# Altium project robocar.PrjPcb
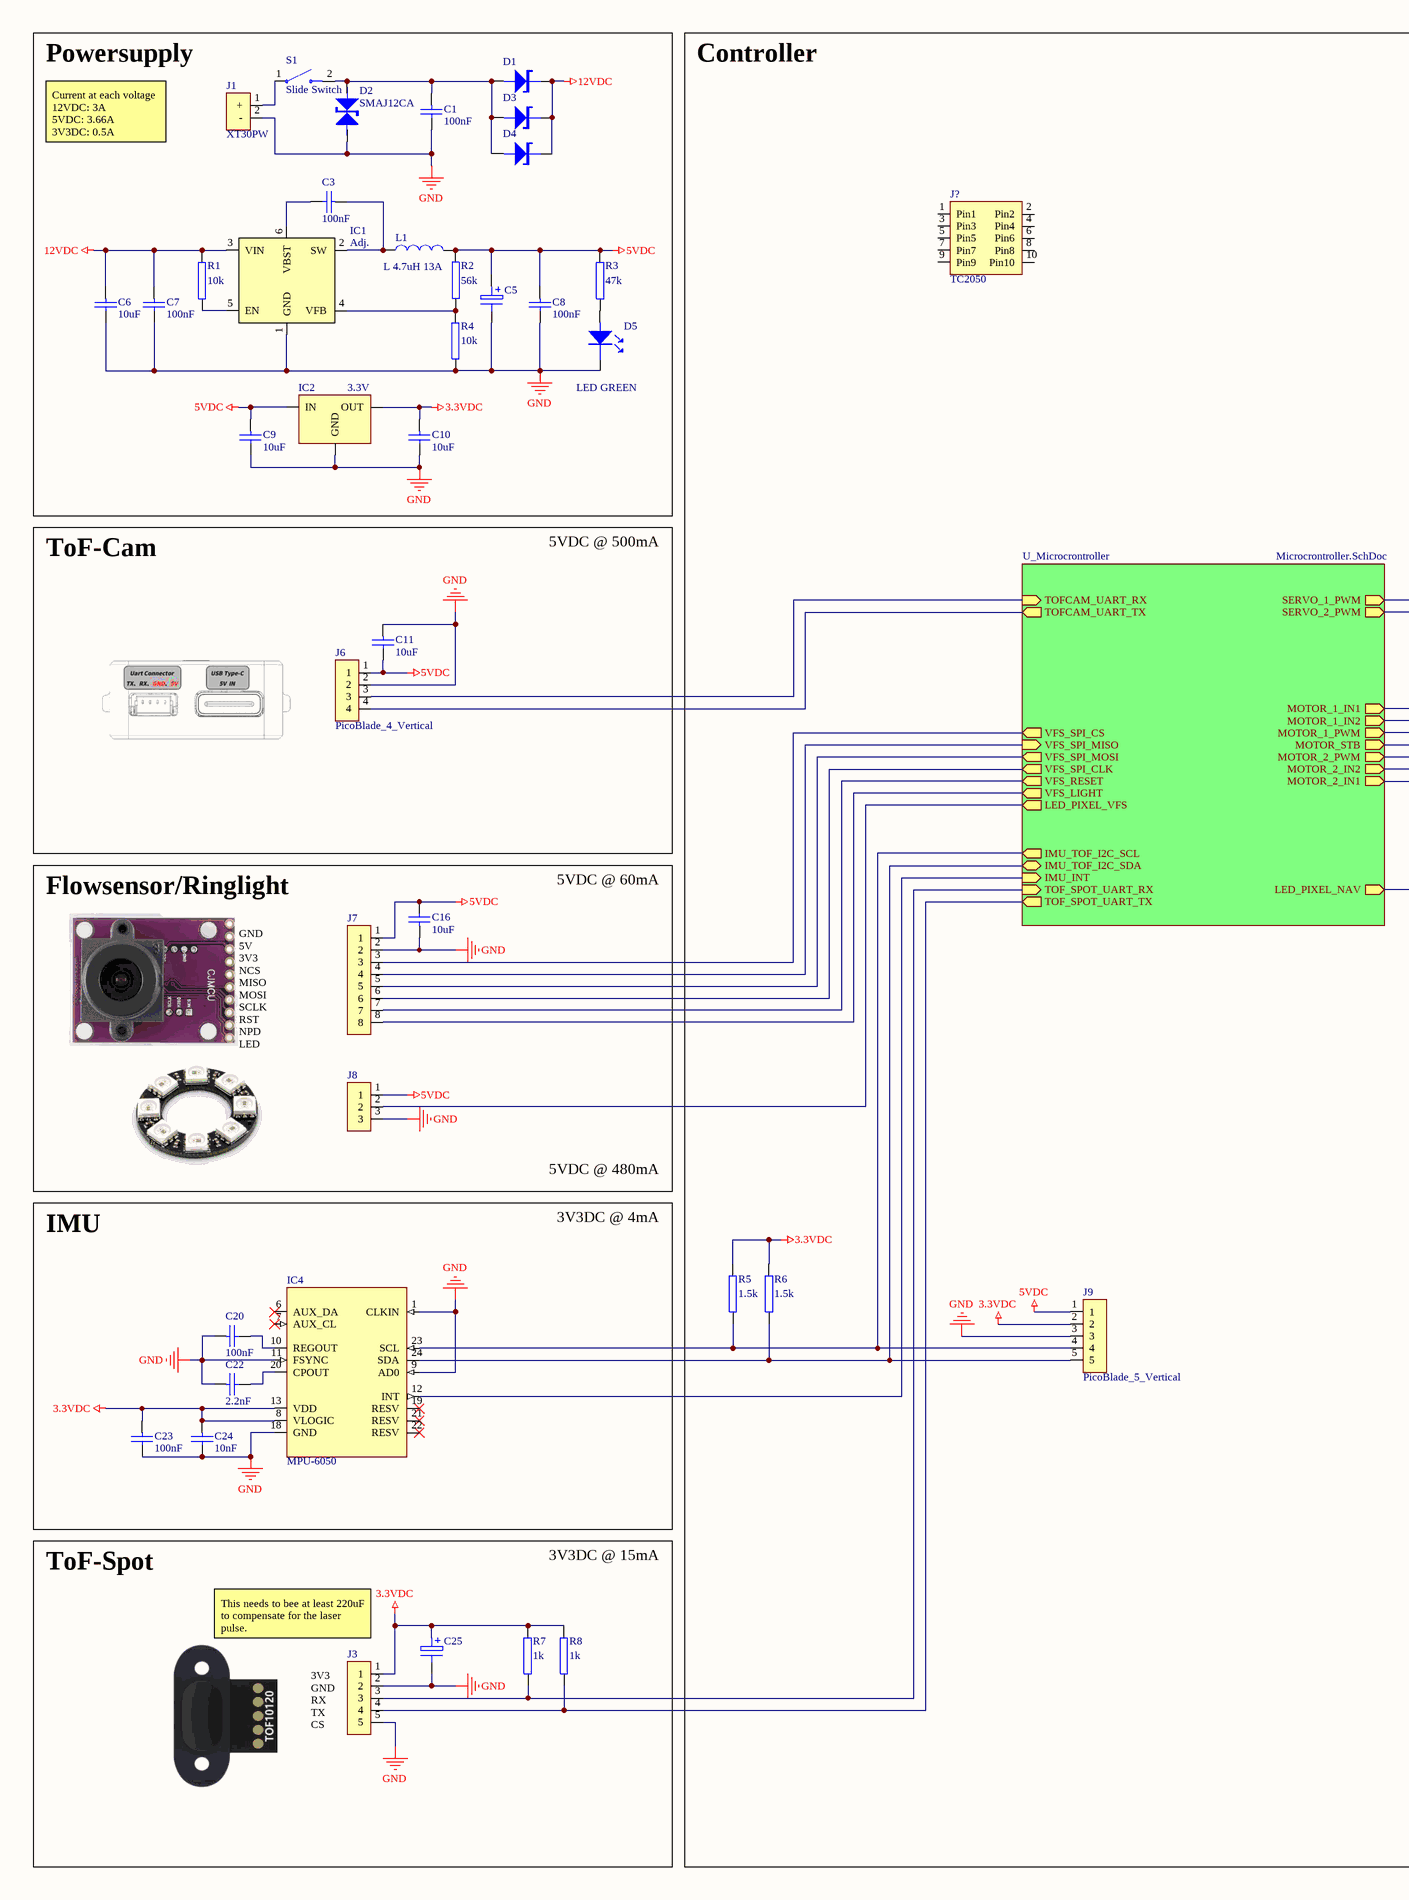
[diagram p0: robocar.SchDoc, left]
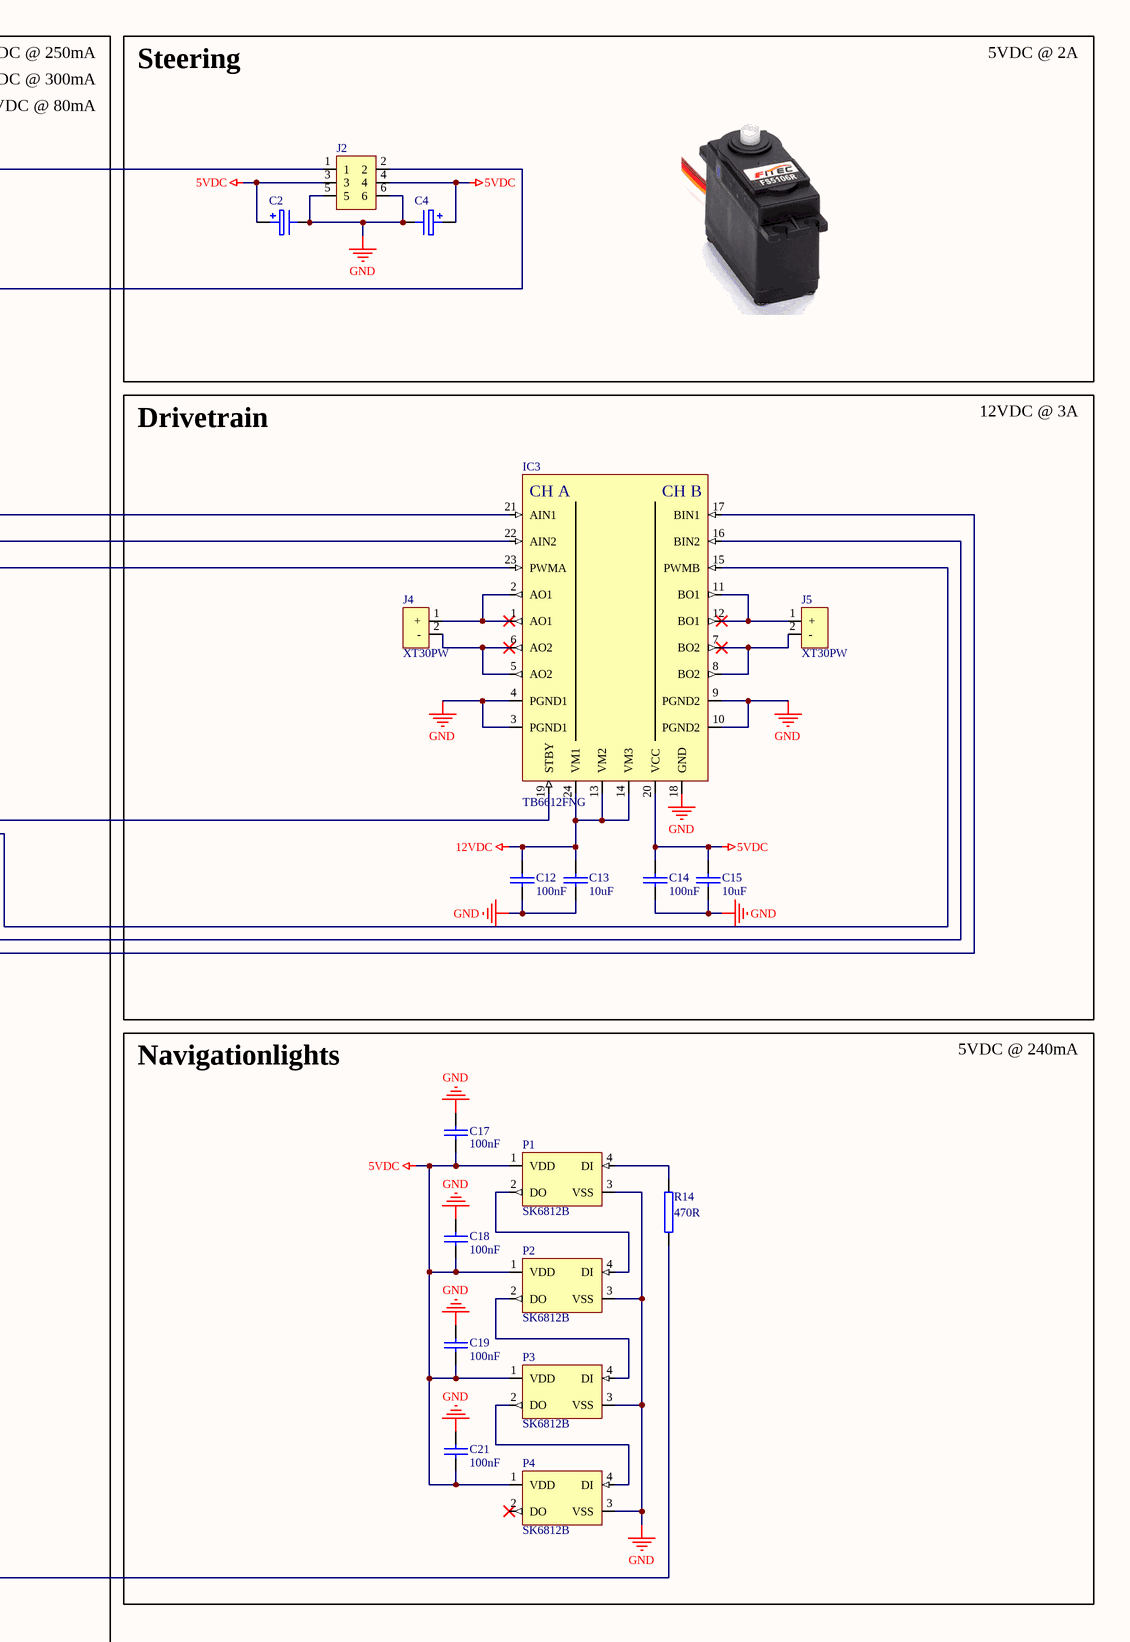
[diagram p1: robocar.SchDoc, right]
2 sheets, 89 parts. Net scope: hierarchical (ports join the sheet entries above them; power ports are global).
Board file: pcb.PcbDoc
Sheets:
  robocar.SchDoc
    U_Microcrontroller = Microcrontroller.SchDoc

## Sheet robocar.SchDoc: FHGR_A3_landscape
size A2; Date: 18.07.2017; DrawnBy: G.P. Catregn; Organization: HTW Chur; Address1: Pulvermühlestrasse 57; Address2: 7004 Chur; Address3: Switzerland; DocumentNumber: 1; Revision: V1.0; SheetNumber: 1; SheetTotal: 2; DocumentName: HTW Template

### Parts
C1  value 100nF  [0603]  (hidden comment: C 100nF 0603)
C2  C 47uF ALUM  [HA1C470WR]  (value not drawn)
C3  value 100nF  [0603]  (hidden comment: C 100nF 0603)
C4  C 47uF ALUM  [HA1C470WR]  (value not drawn)
C5  C 47uF ALUM  [HA1C470WR]  (value not drawn)
C6  value 10uF  [C_1210_A]  (hidden comment: C 10uF 1210)
C7  value 100nF  [0603]  (hidden comment: C 100nF 0603)
C8  value 100nF  [0603]  (hidden comment: C 100nF 0603)
C9  value 10uF  [0603]  (hidden comment: C 10uF 0603)
C10  value 10uF  [0603]  (hidden comment: C 10uF 0603)
C11  value 10uF  [0603]  (hidden comment: C 10uF 0603)
C12  value 100nF  [0603]  (hidden comment: C 100nF 0603)
C13  value 10uF  [C_1210_A]  (hidden comment: C 10uF 1210)
C14  value 100nF  [0603]  (hidden comment: C 100nF 0603)
C15  value 10uF  [0603]  (hidden comment: C 10uF 0603)
C16  value 10uF  [0603]  (hidden comment: C 10uF 0603)
C17  value 100nF  [0603]  (hidden comment: C 100nF 0603)
C18  value 100nF  [0603]  (hidden comment: C 100nF 0603)
C19  value 100nF  [0603]  (hidden comment: C 100nF 0603)
C20  value 100nF  [0603]  (hidden comment: C 100nF 0603)
C21  value 100nF  [0603]  (hidden comment: C 100nF 0603)
C22  value 2.2nF  [0603]  (hidden comment: C 2.2nF 0603)
C23  value 100nF  [0603]  (hidden comment: C 100nF 0603)
C24  value 10nF  [0603]  (hidden comment: C 10nF 0603)
C25  (no value)  [UCD1H221MNL1GS]
D1  Schottky 60V/2A  [SOD-123FL]  (value not drawn)
D2  SMAJ12CA  [SMA]
D3  Schottky 60V/2A  [SOD-123FL]  (value not drawn)
D4  Schottky 60V/2A  [SOD-123FL]  (value not drawn)
D5  LED GREEN  [LED_1206]
IC1  Voltage Out: Adj.  [SOT23-6]  (hidden comment: Buck_5A_17V)
IC2  Voltage Out: 3.3V  [SOT223]  (hidden comment: LDO_1A_3V3)
IC3  TB6612FNG  [SOP65P760X160-24N]
IC4  MPU-6050  [MPU_6050]
J1  XT30PW  [XT30PW-UP-M]
J2  Pinheader_2x3  [61300621121]  (value not drawn)
J3  PicoBlade_5_Vertical  [PicoBlade_5_Vertical]  (value not drawn)
J4  XT30PW  [XT30PW-UP-F]
J5  XT30PW  [XT30PW-UP-F]
J6  PicoBlade_4_Vertical  [PicoBlade_4_Vertical]
J7  PicoBlade_8_Vertical  [PicoBlade_8_Vertical]  (value not drawn)
J8  PicoBlade_3_Vertical  [PicoBlade_3_Vertical]  (value not drawn)
J9  PicoBlade_5_Vertical  [PicoBlade_5_Vertical]
J?  TC2050  [TC2050]
L1  L 4.7uH 13A  [SRP1040VA]
P1  SK6812B  [SK6812B]
P2  SK6812B  [SK6812B]
P3  SK6812B  [SK6812B]
P4  SK6812B  [SK6812B]
R1  value 10k  [0805]  (hidden comment: R 10K 0805)
R2  value 56k  [0805]  (hidden comment: R 56K 0805)
R3  value 47k  [0805]  (hidden comment: R 47K 0805)
R4  value 10k  [0805]  (hidden comment: R 10K 0805)
R5  value 1.5k  [0805]  (hidden comment: R 1K5 0805)
R6  value 1.5k  [0805]  (hidden comment: R 1K5 0805)
R7  value 1k  [0805]  (hidden comment: R 1K 0805)
R8  value 1k  [0805]  (hidden comment: R 1K 0805)
R14  value 470R  [0805]  (hidden comment: R 220R 0805)
S1  Slide Switch  [SW_GF_123_0054]

### Blocks framed on the sheet
Powersupply: C1 C3 C5-C10 D1-D5 IC1 IC2 J1 L1 R1-R4 S1
Controller: J9 J? R5 R6
Steering: C2 C4 J2
Drivetrain: C12-C15 IC3 J4 J5
ToF-Cam: C11 J6
Flowsensor/Ringlight: C16 J7 J8
Navigationlights: C17-C19 C21 P1-P4 R14
IMU: C20 C22-C24 IC4
ToF-Spot: C25 J3 R7 R8

### Sub-sheets
U_Microcrontroller = Microcrontroller.SchDoc: TOFCAM_UART_RX (in), VFS_SPI_MOSI (out), VFS_SPI_MISO (in), VFS_SPI_CS (out), VFS_SPI_CLK (out), VFS_RESET (out), TOFCAM_UART_TX (out), TOF_SPOT_UART_RX (in), TOF_SPOT_UART_TX (out), LED_PIXEL_VFS (out), LED_PIXEL_NAV (out), IMU_TOF_I2C_SCL (out), IMU_TOF_I2C_SDA (bidir), MOTOR_1_IN1 (out), MOTOR_1_IN2 (out), MOTOR_1_PWM (out), MOTOR_2_IN1 (out), MOTOR_2_IN2 (out), MOTOR_2_PWM (out), MOTOR_STB (out), SERVO_1_PWM (out), SERVO_2_PWM (out), VFS_LIGHT (out), IMU_INT (in)

### Nets
3.3VDC: C10.1 C23.1 C24.1 C25.1 IC2.D(OUT) IC4.8(VLOGIC) IC4.13(VDD) J3.1 J9.2 R5.2 R6.2 R7.2 R8.2
5VDC: C2.1 C4.1 C5.1 C8.1 C9.1 C11.2 C14.1 C15.1 C16.2 C17.1 C18.1 C19.1 C21.1 IC2.S(IN) IC3.20(VCC) J2.3 J2.4 J6.1 J7.1 J8.1 J9.1 L1.2 P1.1(VDD) P2.1(VDD) P3.1(VDD) P4.1(VDD) R2.1 R3.2
12VDC: C6.1 C7.1 C12.1 C13.1 D1.K D3.K D4.K IC1.3(VIN) IC3.13(VM2) IC3.14(VM3) IC3.24(VM1) R1.2
GND: C1.2 C2.2 C4.2 C5.2 C6.2 C7.2 C8.2 C9.2 C10.2 C11.1 C12.2 C13.2 C14.2 C15.2 C16.1 C17.2 C18.2 C19.2 C20.1 C21.2 C22.1 C23.2 C24.2 C25.2 D2.A D5.K IC1.1(GND) IC2.G(GND) IC3.3(PGND1) IC3.4(PGND1) IC3.9(PGND2) IC3.10(PGND2) IC3.18(GND) IC4.1(CLKIN) IC4.9(AD0) IC4.11(FSYNC) IC4.18(GND) J1.2(-) J2.5 J2.6 J3.2 J3.5 J6.2 J7.2 J8.3 J9.3 P1.3(VSS) P2.3(VSS) P3.3(VSS) P4.3(VSS) R4.1
NetC1_1: C1.1 D1.A D2.K D3.A D4.A S1.2(C)
NetC3_1: C3.1 IC1.2(SW) L1.1
NetC3_2: C3.2 IC1.6(VBST)
NetC20_2: C20.2 IC4.10(REGOUT)
NetC22_2: C22.2 IC4.20(CPOUT)
NetD5_A: D5.A R3.1
NetIC1_4: IC1.4(VFB) R2.2 R4.2
NetIC1_5: IC1.5(EN) R1.1
NetIC3_1: IC3.1(AO1) IC3.2(AO1) J4.1(+)
NetIC3_5: IC3.5(AO2) IC3.6(AO2) J4.2(-)
NetIC3_7: IC3.7(BO2) IC3.8(BO2) J5.2(-)
NetIC3_11: IC3.11(BO1) IC3.12(BO1) J5.1(+)
NetIC3_15: IC3.15(PWMB) ; sheet U_Microcrontroller/MOTOR_2_PWM
NetIC3_16: IC3.16(BIN2) ; sheet U_Microcrontroller/MOTOR_2_IN2
NetIC3_17: IC3.17(BIN1) ; sheet U_Microcrontroller/MOTOR_2_IN1
NetIC3_19: IC3.19(STBY) ; sheet U_Microcrontroller/MOTOR_STB
NetIC3_21: IC3.21(AIN1) ; sheet U_Microcrontroller/MOTOR_1_IN1
NetIC3_22: IC3.22(AIN2) ; sheet U_Microcrontroller/MOTOR_1_IN2
NetIC3_23: IC3.23(PWMA) ; sheet U_Microcrontroller/MOTOR_1_PWM
NetIC4_12: IC4.12(INT) ; sheet U_Microcrontroller/IMU_INT
NetIC4_23: IC4.23(SCL) J9.4 R5.1 ; sheet U_Microcrontroller/IMU_TOF_I2C_SCL
NetIC4_24: IC4.24(SDA) J9.5 R6.1 ; sheet U_Microcrontroller/IMU_TOF_I2C_SDA
NetIC5_8: J7.7 ; sheet U_Microcrontroller/VFS_RESET
NetIC5_9: J7.5 ; sheet U_Microcrontroller/VFS_SPI_MOSI
NetIC5_10: J7.4 ; sheet U_Microcrontroller/VFS_SPI_MISO
NetIC5_29: R14.1 ; sheet U_Microcrontroller/LED_PIXEL_NAV
NetIC5_33: J7.3 ; sheet U_Microcrontroller/VFS_SPI_CS
NetIC5_34: J7.6 ; sheet U_Microcrontroller/VFS_SPI_CLK
NetIC5_37: J6.3 ; sheet U_Microcrontroller/TOFCAM_UART_RX
NetIC5_38: J6.4 ; sheet U_Microcrontroller/TOFCAM_UART_TX
NetIC5_51: J3.3 R7.1 ; sheet U_Microcrontroller/TOF_SPOT_UART_RX
NetIC5_52: J3.4 R8.1 ; sheet U_Microcrontroller/TOF_SPOT_UART_TX
NetIC5_53: J7.8 ; sheet U_Microcrontroller/VFS_LIGHT
NetIC5_58: J2.1 ; sheet U_Microcrontroller/SERVO_1_PWM
NetIC5_59: J2.2 ; sheet U_Microcrontroller/SERVO_2_PWM
NetJ1_1: J1.1(+) S1.1(A)
NetJ8_2: J8.2 ; sheet U_Microcrontroller/LED_PIXEL_VFS
NetP1_2: P1.2(DO) P2.4(DI)
NetP1_4: P1.4(DI) R14.2
NetP2_2: P2.2(DO) P3.4(DI)
NetP3_2: P3.2(DO) P4.4(DI)

Not connected (* = marked no-connect by the designer): IC4 6(AUX_DA)* 7(AUX_CL)* 19(RESV)* 21(RESV)* 22(RESV)*; J? 1(Pin1) 2(Pin2) 3(Pin3) 4(Pin4) 5(Pin5) 6(Pin6) 7(Pin7) 8(Pin8) 9(Pin9) 10(Pin10); P4 2(DO)*

### Notes on the sheet
- STM32: 3V3DC @ 250mA
- ESP32: 5VDC @ 300mA
- Stati: 5VDC @ 80mA
- 5VDC @ 2A
- Current at each voltage
  12VDC: 3A
  5VDC: 3.66A
  3V3DC: 0.5A
- 12VDC @ 3A
- 5VDC @ 500mA
- 5VDC @ 60mA
- 5VDC @ 240mA
- GND
  5V
  3V3
  NCS
  MISO
  MOSI
  SCLK
  RST
  NPD
  LED
- 5VDC @ 480mA
- 3V3DC @ 4mA
- 3V3DC @ 15mA
- (near J3) This needs to bee at least 220uF to compensate for the laser pulse.
- (near J3) 3V3
  GND
  RX
  TX
  CS
- Drawn by:
- Title:
- Date:
- File:
- Sheet
- of
- Size:
- Revision:
- A2
- (in symbol TB6612FNG) CH A; CH B

### Library data of the parts
C1 C3 C7 C8 C12 C14 C17-C21 C23 = C_100nF_0603: TempKoeff: Y5V; Tolerance: -20%/+80%; Voltage: 50V; Part ID: C_100nF_0603; Price 1pc (CHF): 0.1; Supplier 1: Digi-Key; Supplier Part Number 1: 1276-1012-1-ND
C2 C4 C5 = C_47uF_ALUM: Tolerance: 20%; Voltage: 16V; VALUE: 47uF; Part ID: C_47uF_ALUM; Price 1pc (CHF): 0.08; Supplier 1: Digi-Key; Supplier Part Number 1: PCE4190TR-ND
C6 C13 = C_10uF_1210: TempKoeff: X7S; Tolerance: 10%; Voltage: 50V; Part ID: C_10uF_1210; Price 1pc (CHF): 0.81; Supplier 1: Digi-Key; Supplier Part Number 1: 445-7004-1-ND
C9-C11 C15 C16 = C_10uF_0603: TempKoeff: X5R; Tolerance: 10%; Voltage: 16V; Part ID: C_10uF_0603; Price 1pc (CHF): 0.40; Supplier 1: Digi-Key; Supplier Part Number 1: 490-12317-1-ND
C22 = C_2200pF_0603: TempKoeff: X7R; Tolerance: 10%; Voltage: 50V; Part ID: C_2200pF_0603; Price 1pc (CHF): 0.1; Supplier 1: Digi-Key; Supplier Part Number 1: 399-1085-1-ND
C24 = C_10000pF_0603: TempKoeff: X7R; Tolerance: 10%; Voltage: 50V; Part ID: C_10000pF_0603; Price 1pc (CHF): 0.10; Supplier 1: Digi-Key; Supplier Part Number 1: 1276-1009-1-ND
C25 = C_200u: Supplier 1: Digi-Key; Supplier Part Number 1: 493-6390-1-ND
D1 D3 D4 = D_NTS260ESF: Voltage: 60V; Current: 2A; Forward Voltage: 650mV@2A; Part ID: D_NTS260ESF; Price 10pcs: 0.29; Supplier 1: Digi-Key; ComponentLink1Description: Datasheet; ComponentLink1URL: https://www.onsemi.com/pub/Collateral/NTS260ESF-D.PDF; Supplier Part Number 1: NTS260ESFT3GOSCT-ND
D2 = D_SMAJ12CA: Voltage: 12V; Current: 20.1A; Part ID: D_SMAJ12CA; Price 10pcs: 0.39; Supplier 1: Digi-Key; ComponentLink1Description: Datasheet; ComponentLink1URL: https://www.mccsemi.com/pdf/Products/SMAJ5.0-SMAJ440CA(SMA).pdf; Supplier Part Number 1: SMAJ12CA-TPMSCT-ND
D5 = LED_GREEN_1206: Peak Wavelenght: 565nm; Part ID: LED_GREEN_1206; Price 10pcs: 0.226; Supplier 1: Digi-Key; Supplier Part Number 1: 67-1357-1-ND; ComponentLink1Description: Datasheet; ComponentLink1URL: https://media.digikey.com/pdf/Data%20Sheets/Lite-On%20PDFs/LTST-C230KGKT.pdf
IC1 = TPS565208: Voltage Max: 17; Current: 5A; Frequency: 500kHz; Part ID: TPS565208; Price 10pcs: 1.1; Supplier 1: Digi-Key; ComponentLink1Description: Datasheet; ComponentLink1URL: https://www.ti.com/general/docs/suppproductinfo.tsp?distId=10&gotoUrl=https%3A%2F%2Fwww.ti.com%2Flit%2Fgpn%2Ftps565208; Supplier Part Number 1: 296-48755-1-ND
IC2 = NCP1117LP: IC NCP1117LP LDO; Voltage Max: 18V; Current: 1A; Part ID: NCP1117LP; Price 10pcs: 0.34; Supplier 1: Digi-Key; ComponentLink1Description: Datasheet; ComponentLink1URL: https://www.onsemi.com/pdf/datasheet/ncp1117lp-d.pdf; Supplier Part Number 1: NCP1117LPST33T3GOSCT-ND
L1 = L_4.7uH_13A: Tolerance: 20%; VALUE: 4.7uH; Part ID: L_4.7uH_13A; Price 1pc (CHF): 2.03; Size: 11mm x 10mm x 4mm; Current: 13A; Supplier 1: Digi-Key; ComponentLink1URL: https://www.bourns.com/docs/product-datasheets/srp1040va.pdf; ComponentLink1Description: Datasheet; Supplier Part Number 1: 118-SRP1040VA-4R7MCT-ND
P1-P4 = SK6812B: Angled; ComponentLink1Description: Supplier; ComponentLink1URL: https://www.digikey.ch/en/products/detail/adafruit-industries-llc/4691/13170955
R1 R4 = R_10k_0805: Tolerance: 1%; Power Dissipation: 125mW; Part ID: R_10k_0805; Price 10pcs (CHF): 0.021; Supplier 1: Digi-Key; Supplier Part Number 1: 311-10.0KCRCT-ND
R2 = R_56k_0805: Tolerance: 1%; Power Dissipation: 125mW; Part ID: R_56k_0805; Price 10pcs (CHF): 0.045; Supplier 1: Digi-Key; Supplier Part Number 1: 311-56.0KCRCT-ND
R3 = R_47k_0805: Tolerance: 1%; Power Dissipation: 125mW; Part ID: R_47k_0805; Price 10pcs (CHF): 0.09; Supplier 1: Digi-Key; Supplier Part Number 1: A106064CT-ND
R5 R6 = R_1k5_0805: Tolerance: 1%; Power Dissipation: 250mW; Part ID: R_1k5_0805; Price 10pcs (CHF): 0.072; Supplier 1: Digi-Key; Supplier Part Number 1: RNCP0805FTD1K50CT-ND
R7 R8 = R_1k_0805: Tolerance: 1%; Power Dissipation: 125mW; Part ID: R_1k_0805; Price 10pcs (CHF): 0.021; Supplier 1: Digi-Key; Supplier Part Number 1: 311-1.00KCRCT-ND
R14 = R_220R_0805: Tolerance: 1%; Power Dissipation: 125mW; Part ID: R_220R_0805; Price 10pcs (CHF): 0.052; Supplier 1: Digi-Key; Supplier Part Number 1: A129741CT-ND
S1 = Slide_Switch: Voltage: 125V; Current: 8.5A; Part ID: Slide_Switch; Price 1pc (CHF): 1.17; Dimension: 10mmx16.5mmx8.8mm; Supplier 1: Digi-Key; ComponentLink1Description: Datasheet; ComponentLink1URL: https://media.digikey.com/pdf/Data%20Sheets/CW%20Industries%20PDFs/GF-123-0054_Dwg.pdf; Supplier Part Number 1: CWI333-ND
IC3 = TB6612FNG: ComponentLink1Description: Datasheet; ComponentLink1URL: https://toshiba.semicon-storage.com/info/TB6612FNG_datasheet_en_20141001.pdf?did=10660&prodName=TB6612FNG; Supplier 1: Arrow Electronics; Supplier Part Number 1: TB6612FNG,C,8,EL
J2 = Pinheader_2x3: Supplier 1: Rs; Supplier Part Number 1: 8281522P
J3 J9 = PicoBlade_5_Vertical: Supplier 1: Mouser; Supplier Part Number 1: 538-53047-0510
J6 = PicoBlade_4_Vertical: Supplier 1: Mouser; Supplier Part Number 1: 538-53047-0410
J7 = PicoBlade_8_Vertical: Supplier 1: Mouser; Supplier Part Number 1: 538-53047-0810
J8 = PicoBlade_3_Vertical: Supplier 1: Mouser; Supplier Part Number 1: 538-53047-0310

## Sheet Microcrontroller.SchDoc: FHGR_A3_landscape
size A2; Date: 18.07.2017; DrawnBy: G.P. Catregn; Organization: HTW Chur; Address1: Pulvermühlestrasse 57; Address2: 7004 Chur; Address3: Switzerland; DocumentNumber: 1; Revision: V1.0; SheetNumber: 2; SheetTotal: 2; DocumentName: HTW Template
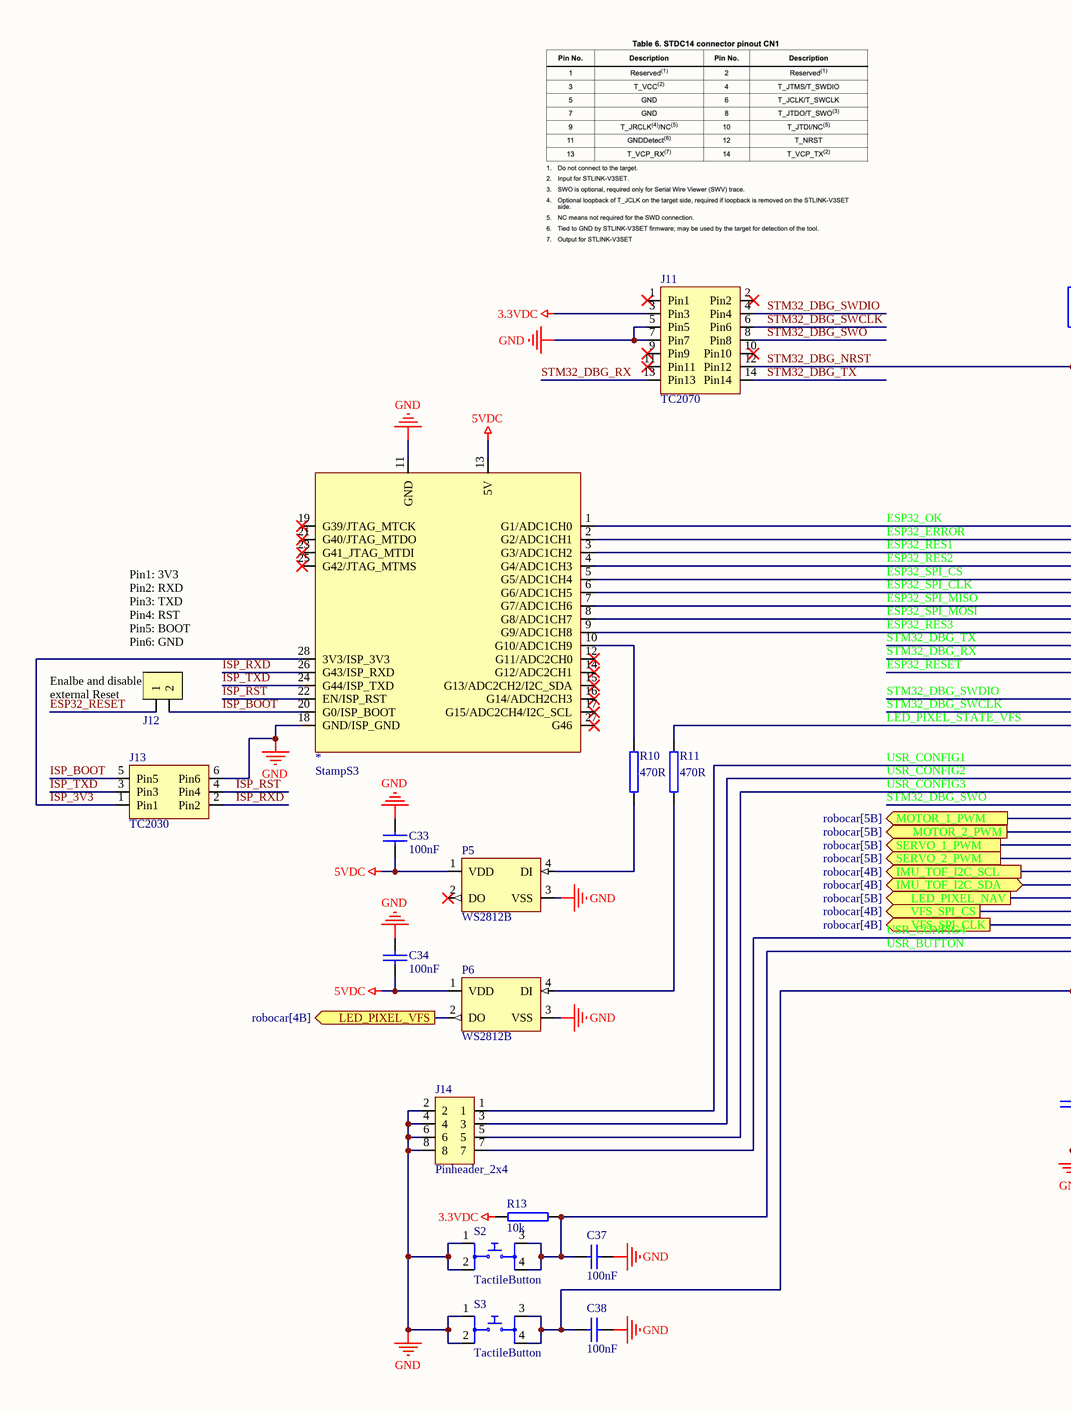
[diagram p2: Microcrontroller.SchDoc, left]
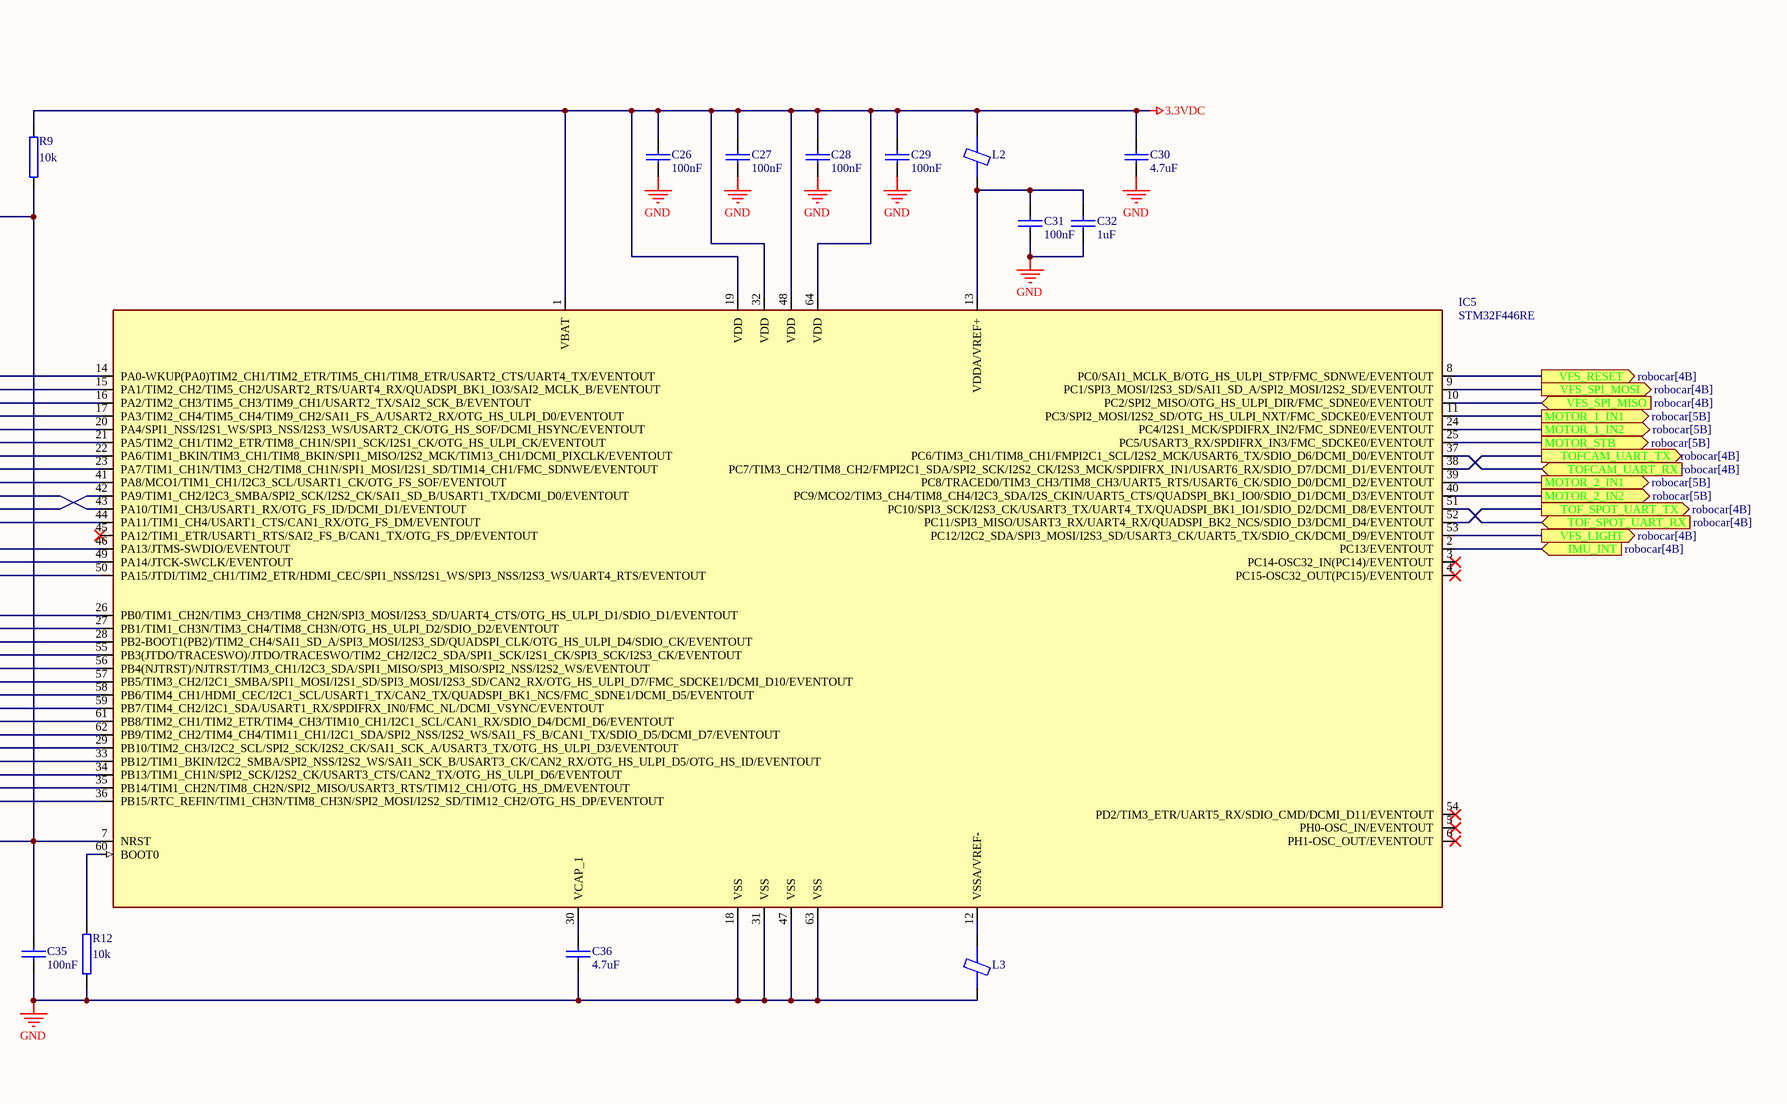
[diagram p3: Microcrontroller.SchDoc, right]

### Parts
*  StampS3  [Stamp-S3-SMD]
C26  value 100nF  [0603]  (hidden comment: C 100nF 0603)
C27  value 100nF  [0603]  (hidden comment: C 100nF 0603)
C28  value 100nF  [0603]  (hidden comment: C 100nF 0603)
C29  value 100nF  [0603]  (hidden comment: C 100nF 0603)
C30  value 4.7uF  [0603]  (hidden comment: C 4.7uF 0603)
C31  value 100nF  [0603]  (hidden comment: C 100nF 0603)
C32  value 1uF  [0603]  (hidden comment: C 1uF 0603)
C33  value 100nF  [0603]  (hidden comment: C 100nF 0603)
C34  value 100nF  [0603]  (hidden comment: C 100nF 0603)
C35  value 100nF  [0603]  (hidden comment: C 100nF 0603)
C36  value 4.7uF  [0603]  (hidden comment: C 4.7uF 0603)
C37  value 100nF  [0603]  (hidden comment: C 100nF 0603)
C38  value 100nF  [0603]  (hidden comment: C 100nF 0603)
IC5  STM32F446RE  [STM32F446RET6]
J11  TC2070  [TC2070]
J12  2Pin_Male  [Header1x2_254]  (value not drawn)
J13  TC2030  [TC2030]
J14  Pinheader_2x4  [61300821121]
L2  L Ferrit Bead  [0805]  (value not drawn)
L3  L Ferrit Bead  [0805]  (value not drawn)
P5  WS2812B  [WS2812B_SMD]
P6  WS2812B  [WS2812B_SMD]
R9  value 10k  [0805]  (hidden comment: R 10K 0805)
R10  value 470R  [0805]  (hidden comment: R 220R 0805)
R11  value 470R  [0805]  (hidden comment: R 220R 0805)
R12  value 10k  [0805]  (hidden comment: R 10K 0805)
R13  value 10k  [0805]  (hidden comment: R 10K 0805)
S2  TactileButton  [TactileButton-6x6mm]
S3  TactileButton  [TactileButton-6x6mm]

### Ports
IMU_INT (in, see robocar[4B]), IMU_TOF_I2C_SCL (out, see robocar[4B]), IMU_TOF_I2C_SDA (bidir, see robocar[4B]), LED_PIXEL_NAV (out, see robocar[5B]), LED_PIXEL_VFS (out, see robocar[4B]), MOTOR_1_IN1 (out, see robocar[5B]), MOTOR_1_IN2 (out, see robocar[5B]), MOTOR_1_PWM (out, see robocar[5B]), MOTOR_2_IN1 (out, see robocar[5B]), MOTOR_2_IN2 (out, see robocar[5B]), MOTOR_2_PWM (out, see robocar[5B]), MOTOR_STB (out, see robocar[5B]), SERVO_1_PWM (out, see robocar[5B]), SERVO_2_PWM (out, see robocar[5B]), TOF_SPOT_UART_RX (in, see robocar[4B]), TOF_SPOT_UART_TX (out, see robocar[4B]), TOFCAM_UART_RX (in, see robocar[4B]), TOFCAM_UART_TX (out, see robocar[4B]), VFS_LIGHT (out, see robocar[4B]), VFS_RESET (out, see robocar[4B]), VFS_SPI_CLK (out, see robocar[4B]), VFS_SPI_CS (out, see robocar[4B]), VFS_SPI_MISO (in, see robocar[4B]), VFS_SPI_MOSI (out, see robocar[4B])

### Nets
3.3VDC: C26.1 C27.1 C28.1 C29.1 C30.1 IC5.1(VBAT) IC5.19(VDD) IC5.32(VDD) IC5.48(VDD) IC5.64(VDD) J11.3(Pin3) L2.2 R9.2 R13.2
5VDC: *.13(5V) C33.1 C34.1 P5.1(VDD) P6.1(VDD)
GND: *.11(GND) *.18(GND/ISP_GND) C26.2 C27.2 C28.2 C29.2 C30.2 C31.2 C32.2 C33.2 C34.2 C35.2 C36.2 C37.1 C38.1 IC5.18(VSS) IC5.31(VSS) IC5.47(VSS) IC5.63(VSS) J11.5(Pin5) J11.7(Pin7) J13.6(Pin6) J14.2 J14.4 J14.6 J14.8 L3.2 P5.3(VSS) P6.3(VSS) R12.2 S2.1 S2.2 S3.1 S3.2
ESP32_ERROR: *.2(G2/ADC1CH1) IC5.15(PA1/TIM2_CH2/TIM5_CH2/USART2_RTS/UART4_RX/QUADSPI_BK1_IO3/SAI2_MCLK_B/EVENTOUT)
ESP32_OK: *.1(G1/ADC1CH0) IC5.14(PA0-WKUP(PA0)TIM2_CH1/TIM2_ETR/TIM5_CH1/TIM8_ETR/USART2_CTS/UART4_TX/EVENTOUT)
ESP32_RES1: *.3(G3/ADC1CH2) IC5.16(PA2/TIM2_CH3/TIM5_CH3/TIM9_CH1/USART2_TX/SAI2_SCK_B/EVENTOUT)
ESP32_RES2: *.4(G4/ADC1CH3) IC5.17(PA3/TIM2_CH4/TIM5_CH4/TIM9_CH2/SAI1_FS_A/USART2_RX/OTG_HS_ULPI_D0/EVENTOUT)
ESP32_RES3: *.9(G9/ADC1CH8) IC5.41(PA8/MCO1/TIM1_CH1/I2C3_SCL/USART1_CK/OTG_FS_SOF/EVENTOUT)
ESP32_RESET: IC5.44(PA11/TIM1_CH4/USART1_CTS/CAN1_RX/OTG_FS_DM/EVENTOUT) J12.1
ESP32_SPI_CLK: *.6(G6/ADC1CH5) IC5.21(PA5/TIM2_CH1/TIM2_ETR/TIM8_CH1N/SPI1_SCK/I2S1_CK/OTG_HS_ULPI_CK/EVENTOUT)
ESP32_SPI_CS: *.5(G5/ADC1CH4) IC5.20(PA4/SPI1_NSS/I2S1_WS/SPI3_NSS/I2S3_WS/USART2_CK/OTG_HS_SOF/DCMI_HSYNC/EVENTOUT)
ESP32_SPI_MISO: *.7(G7/ADC1CH6) IC5.22(PA6/TIM1_BKIN/TIM3_CH1/TIM8_BKIN/SPI1_MISO/I2S2_MCK/TIM13_CH1/DCMI_PIXCLK/EVENTOUT)
ESP32_SPI_MOSI: *.8(G8/ADC1CH7) IC5.23(PA7/TIM1_CH1N/TIM3_CH2/TIM8_CH1N/SPI1_MOSI/I2S1_SD/TIM14_CH1/FMC_SDNWE/EVENTOUT)
ISP_3V3: *.28(3V3/ISP_3V3) J13.1(Pin1)
ISP_BOOT: *.20(G0/ISP_BOOT) J12.2 J13.5(Pin5)
ISP_RST: *.22(EN/ISP_RST) J13.4(Pin4)
ISP_RXD: *.26(G43/ISP_RXD) J13.2(Pin2)
ISP_TXD: *.24(G44/ISP_TXD) J13.3(Pin3)
LED_PIXEL_STATE_VFS: IC5.50(PA15/JTDI/TIM2_CH1/TIM2_ETR/HDMI_CEC/SPI1_NSS/I2S1_WS/SPI3_NSS/I2S3_WS/UART4_RTS/EVENTOUT) R11.2
STM32_DBG_NRST: C35.1 C38.2 IC5.7(NRST) J11.12(Pin12) R9.1 S3.3 S3.4
STM32_DBG_RX: IC5.42(PA9/TIM1_CH2/I2C3_SMBA/SPI2_SCK/I2S2_CK/SAI1_SD_B/USART1_TX/DCMI_D0/EVENTOUT) J11.13(Pin13)
STM32_DBG_SWCLK: IC5.49(PA14/JTCK-SWCLK/EVENTOUT) J11.6(Pin6)
STM32_DBG_SWDIO: IC5.46(PA13/JTMS-SWDIO/EVENTOUT) J11.4(Pin4)
STM32_DBG_SWO: IC5.55(PB3(JTDO/TRACESWO)/JTDO/TRACESWO/TIM2_CH2/I2C2_SDA/SPI1_SCK/I2S1_CK/SPI3_SCK/I2S3_CK/EVENTOUT) J11.8(Pin8)
STM32_DBG_TX: IC5.43(PA10/TIM1_CH3/USART1_RX/OTG_FS_ID/DCMI_D1/EVENTOUT) J11.14(Pin14)
USR_BUTTON: C37.2 IC5.36(PB15/RTC_REFIN/TIM1_CH3N/TIM8_CH3N/SPI2_MOSI/I2S2_SD/TIM12_CH2/OTG_HS_DP/EVENTOUT) R13.1 S2.3 S2.4
USR_CONFIG1: IC5.26(PB0/TIM1_CH2N/TIM3_CH3/TIM8_CH2N/SPI3_MOSI/I2S3_SD/UART4_CTS/OTG_HS_ULPI_D1/SDIO_D1/EVENTOUT) J14.1
USR_CONFIG2: IC5.27(PB1/TIM1_CH3N/TIM3_CH4/TIM8_CH3N/OTG_HS_ULPI_D2/SDIO_D2/EVENTOUT) J14.3
USR_CONFIG3: IC5.28(PB2-BOOT1(PB2)/TIM2_CH4/SAI1_SD_A/SPI3_MOSI/I2S3_SD/QUADSPI_CLK/OTG_HS_ULPI_D4/SDIO_CK/EVENTOUT) J14.5
USR_CONFIG4: IC5.35(PB14/TIM1_CH2N/TIM8_CH2N/SPI2_MISO/USART3_RTS/TIM12_CH1/OTG_HS_DM/EVENTOUT) J14.7
Net*_10: *.10(G10/ADC1CH9) R10.2
NetC31_1: C31.1 C32.1 IC5.13(VDDA/VREF+) L2.1
NetC36_1: C36.1 IC5.30(VCAP_1)
NetIC3_15: IC5.57(PB5/TIM3_CH2/I2C1_SMBA/SPI1_MOSI/I2S1_SD/SPI3_MOSI/I2S3_SD/CAN2_RX/OTG_HS_ULPI_D7/FMC_SDCKE1/DCMI_D10/EVENTOUT) ; port MOTOR_2_PWM
NetIC3_16: IC5.40(PC9/MCO2/TIM3_CH4/TIM8_CH4/I2C3_SDA/I2S_CKIN/UART5_CTS/QUADSPI_BK1_IO0/SDIO_D1/DCMI_D3/EVENTOUT) ; port MOTOR_2_IN2
NetIC3_17: IC5.39(PC8/TRACED0/TIM3_CH3/TIM8_CH3/UART5_RTS/USART6_CK/SDIO_D0/DCMI_D2/EVENTOUT) ; port MOTOR_2_IN1
NetIC3_19: IC5.25(PC5/USART3_RX/SPDIFRX_IN3/FMC_SDCKE0/EVENTOUT) ; port MOTOR_STB
NetIC3_21: IC5.11(PC3/SPI2_MOSI/I2S2_SD/OTG_HS_ULPI_NXT/FMC_SDCKE0/EVENTOUT) ; port MOTOR_1_IN1
NetIC3_22: IC5.24(PC4/I2S1_MCK/SPDIFRX_IN2/FMC_SDNE0/EVENTOUT) ; port MOTOR_1_IN2
NetIC3_23: IC5.56(PB4(NJTRST)/NJTRST/TIM3_CH1/I2C3_SDA/SPI1_MISO/SPI3_MISO/SPI2_NSS/I2S2_WS/EVENTOUT) ; port MOTOR_1_PWM
NetIC4_12: IC5.2(PC13/EVENTOUT) ; port IMU_INT
NetIC4_23: IC5.61(PB8/TIM2_CH1/TIM2_ETR/TIM4_CH3/TIM10_CH1/I2C1_SCL/CAN1_RX/SDIO_D4/DCMI_D6/EVENTOUT) ; port IMU_TOF_I2C_SCL
NetIC4_24: IC5.62(PB9/TIM2_CH2/TIM4_CH4/TIM11_CH1/I2C1_SDA/SPI2_NSS/I2S2_WS/SAI1_FS_B/CAN1_TX/SDIO_D5/DCMI_D7/EVENTOUT) ; port IMU_TOF_I2C_SDA
NetIC5_8: IC5.8(PC0/SAI1_MCLK_B/OTG_HS_ULPI_STP/FMC_SDNWE/EVENTOUT) ; port VFS_RESET
NetIC5_9: IC5.9(PC1/SPI3_MOSI/I2S3_SD/SAI1_SD_A/SPI2_MOSI/I2S2_SD/EVENTOUT) ; port VFS_SPI_MOSI
NetIC5_10: IC5.10(PC2/SPI2_MISO/OTG_HS_ULPI_DIR/FMC_SDNE0/EVENTOUT) ; port VFS_SPI_MISO
NetIC5_12: IC5.12(VSSA/VREF-) L3.1
NetIC5_29: IC5.29(PB10/TIM2_CH3/I2C2_SCL/SPI2_SCK/I2S2_CK/SAI1_SCK_A/USART3_TX/OTG_HS_ULPI_D3/EVENTOUT) ; port LED_PIXEL_NAV
NetIC5_33: IC5.33(PB12/TIM1_BKIN/I2C2_SMBA/SPI2_NSS/I2S2_WS/SAI1_SCK_B/USART3_CK/CAN2_RX/OTG_HS_ULPI_D5/OTG_HS_ID/EVENTOUT) ; port VFS_SPI_CS
NetIC5_34: IC5.34(PB13/TIM1_CH1N/SPI2_SCK/I2S2_CK/USART3_CTS/CAN2_TX/OTG_HS_ULPI_D6/EVENTOUT) ; port VFS_SPI_CLK
NetIC5_37: IC5.37(PC6/TIM3_CH1/TIM8_CH1/FMPI2C1_SCL/I2S2_MCK/USART6_TX/SDIO_D6/DCMI_D0/EVENTOUT) ; port TOFCAM_UART_RX
NetIC5_38: IC5.38(PC7/TIM3_CH2/TIM8_CH2/FMPI2C1_SDA/SPI2_SCK/I2S2_CK/I2S3_MCK/SPDIFRX_IN1/USART6_RX/SDIO_D7/DCMI_D1/EVENTOUT) ; port TOFCAM_UART_TX
NetIC5_51: IC5.51(PC10/SPI3_SCK/I2S3_CK/USART3_TX/UART4_TX/QUADSPI_BK1_IO1/SDIO_D2/DCMI_D8/EVENTOUT) ; port TOF_SPOT_UART_RX
NetIC5_52: IC5.52(PC11/SPI3_MISO/USART3_RX/UART4_RX/QUADSPI_BK2_NCS/SDIO_D3/DCMI_D4/EVENTOUT) ; port TOF_SPOT_UART_TX
NetIC5_53: IC5.53(PC12/I2C2_SDA/SPI3_MOSI/I2S3_SD/USART3_CK/UART5_TX/SDIO_CK/DCMI_D9/EVENTOUT) ; port VFS_LIGHT
NetIC5_58: IC5.58(PB6/TIM4_CH1/HDMI_CEC/I2C1_SCL/USART1_TX/CAN2_TX/QUADSPI_BK1_NCS/FMC_SDNE1/DCMI_D5/EVENTOUT) ; port SERVO_1_PWM
NetIC5_59: IC5.59(PB7/TIM4_CH2/I2C1_SDA/USART1_RX/SPDIFRX_IN0/FMC_NL/DCMI_VSYNC/EVENTOUT) ; port SERVO_2_PWM
NetIC5_60: IC5.60(BOOT0) R12.1
NetJ8_2: P6.2(DO) ; port LED_PIXEL_VFS
NetP5_4: P5.4(DI) R10.1
NetP6_4: P6.4(DI) R11.1

Not connected (* = marked no-connect by the designer): * 12(G11/ADC2CH0)* 14(G12/ADC2CH1)* 15(G13/ADC2CH2/I2C_SDA)* 16(G14/ADCH2CH3)* 17(G15/ADC2CH4/I2C_SCL)* 19(G39/JTAG_MTCK)* 21(G40/JTAG_MTDO)* 23(G41_JTAG_MTDI)* 25(G42/JTAG_MTMS)* 27(G46)*; IC5 3(PC14-OSC32_IN(PC14)/EVENTOUT)* 4(PC15-OSC32_OUT(PC15)/EVENTOUT)* 5(PH0-OSC_IN/EVENTOUT)* 6(PH1-OSC_OUT/EVENTOUT)* 45(PA12/TIM1_ETR/USART1_RTS/SAI2_FS_B/CAN1_TX/OTG_FS_DP/EVENTOUT)* 54(PD2/TIM3_ETR/UART5_RX/SDIO_CMD/DCMI_D11/EVENTOUT)*; J11 1(Pin1)* 2(Pin2)* 9(Pin9)* 10(Pin10)* 11(Pin11)*; P5 2(DO)*

### Notes on the sheet
- (near J12) Pin1: 3V3
  Pin2: RXD
  Pin3: TXD
  Pin4: RST
  Pin5: BOOT
  Pin6: GND
- (near J12) Enalbe and disable external Reset
- Drawn by:
- Title:
- Date:
- File:
- Sheet
- of
- Size:
- Revision:
- A2

### Library data of the parts
C26-C29 C31 C33-C35 C37 C38 = C_100nF_0603: as C1 on sheet robocar; Part ID: C_100nF_0603; Price 1pc (CHF): 0.1; Supplier 1: Digi-Key; Supplier Part Number 1: 1276-1012-1-ND
C30 C36 = C_4_7uF_0603: TempKoeff: X5R; Tolerance: 10%; Voltage: 6.3V; Part ID: C_4_7uF_0603; Price 1pc (CHF): 0.1; Supplier 1: Digi-Key; Supplier Part Number 1: 1276-1045-1-ND
C32 = C_1uF_0603: TempKoeff: X7R; Tolerance: 10%; Voltage: 25V; Part ID: C_1uF_0603; Price 1pc (CHF): 0.29; Supplier 1: Digi-Key; Supplier Part Number 1: 1276-6617-1-ND
J12 = Header_2: Part ID: Header_2; Price 1pc (CHF): 0.13; Supplier 1: Digi-Key; ComponentLink1Description: Datasheet; ComponentLink1URL: https://katalog.we-online.de/em/datasheet/6130xx11121.pdf; Supplier Part Number 1: 732-5315-ND
L2 L3 = L_Ferrit_Bead: VALUE: 600Ohm @ 100MHz; Current: 2A; Part ID: L_Ferrit_Bead; Price 1pc (CHF): 0.22; Supplier 1: Digi-Key; ComponentLink1URL: https://katalog.we-online.de/pbs/datasheet/742792040.pdf; ComponentLink1Description: Datasheet; Supplier Part Number 1: 732-1620-1-ND
R9 R12 R13 = R_10k_0805: Tolerance: 1%; Power Dissipation: 125mW; Part ID: R_10k_0805; Price 10pcs (CHF): 0.021; Supplier 1: Digi-Key; Supplier Part Number 1: 311-10.0KCRCT-ND
R10 R11 = R_220R_0805: Tolerance: 1%; Power Dissipation: 125mW; Part ID: R_220R_0805; Price 10pcs (CHF): 0.052; Supplier 1: Digi-Key; Supplier Part Number 1: A129741CT-ND
S2 S3 = TactileButton: Voltage: 12V; Current: 50mA; Part ID: TactileButton; Price 1pc (CHF): 0.59; Dimension: 6.2mmx6.2mmx4.3mm; Supplier 1: Digi-Key; ComponentLink1Description: Datasheet; ComponentLink1URL: https://media.digikey.com/pdf/Data%20Sheets/APEM%20Components%20PDFs/ADTS6,%20ADTSM,%20AKTSC6%20Series.pdf; Supplier Part Number 1: 679-2380-1-ND
IC5 = STM32F446RE: Supplier 1: Mouser; Supplier Part Number 1: 511-STM32F446RET6
J14 = Pinheader_2x4: Supplier 1: Rs; Supplier Part Number 1: 8281522P
P5 P6 = WS2812B: ComponentLink1Description: Datasheet; ComponentLink1URL: http://cdn.sparkfun.com/datasheets/BreakoutBoards/WS2812B.pdf

## Nets that join several sheets
3.3VDC: robocar (13 pins), Microcrontroller (14 pins)
5VDC: robocar (28 pins), Microcrontroller (5 pins)
GND: robocar (51 pins), Microcrontroller (34 pins)
NetIC3_15: robocar (IC3.15), Microcrontroller (IC5.57)
NetIC3_16: robocar (IC3.16), Microcrontroller (IC5.40)
NetIC3_17: robocar (IC3.17), Microcrontroller (IC5.39)
NetIC3_19: robocar (IC3.19), Microcrontroller (IC5.25)
NetIC3_21: robocar (IC3.21), Microcrontroller (IC5.11)
NetIC3_22: robocar (IC3.22), Microcrontroller (IC5.24)
NetIC3_23: robocar (IC3.23), Microcrontroller (IC5.56)
NetIC4_12: robocar (IC4.12), Microcrontroller (IC5.2)
NetIC4_23: robocar (IC4.23 J9.4 R5.1), Microcrontroller (IC5.61)
NetIC4_24: robocar (IC4.24 J9.5 R6.1), Microcrontroller (IC5.62)
NetIC5_8: robocar (J7.7), Microcrontroller (IC5.8)
NetIC5_9: robocar (J7.5), Microcrontroller (IC5.9)
NetIC5_10: robocar (J7.4), Microcrontroller (IC5.10)
NetIC5_29: robocar (R14.1), Microcrontroller (IC5.29)
NetIC5_33: robocar (J7.3), Microcrontroller (IC5.33)
NetIC5_34: robocar (J7.6), Microcrontroller (IC5.34)
NetIC5_37: robocar (J6.3), Microcrontroller (IC5.37)
NetIC5_38: robocar (J6.4), Microcrontroller (IC5.38)
NetIC5_51: robocar (J3.3 R7.1), Microcrontroller (IC5.51)
NetIC5_52: robocar (J3.4 R8.1), Microcrontroller (IC5.52)
NetIC5_53: robocar (J7.8), Microcrontroller (IC5.53)
NetIC5_58: robocar (J2.1), Microcrontroller (IC5.58)
NetIC5_59: robocar (J2.2), Microcrontroller (IC5.59)
NetJ8_2: robocar (J8.2), Microcrontroller (P6.2)